# Altium schematic sheet SD NAND.SchDoc
size A4; SheetNumber: 4; SheetTotal: 5
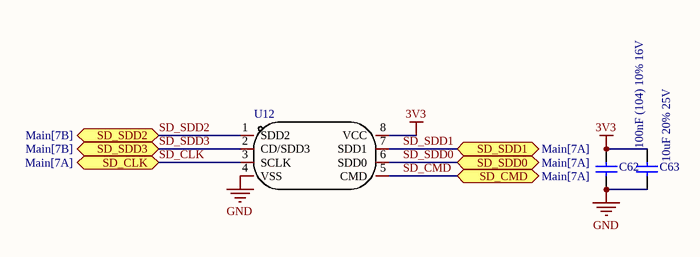
[diagram p0: SD NAND.SchDoc]

## Parts
C62  100nF (104) 10% 16V  [0402_C]
C63  10uF 20% 25V  [0402_C]
U12  CSNP1GCR01-BOW  [LGA-8_L6.0-W8.0-P1.27-TL]  (value not drawn)

## Ports
SD_CLK (bidir, see Main[7A]), SD_CMD (bidir, see Main[7A]), SD_SDD0 (bidir, see Main[7A]), SD_SDD1 (bidir, see Main[7A]), SD_SDD2 (bidir, see Main[7B]), SD_SDD3 (bidir, see Main[7B])

## Nets
3V3: C62.1 C63.2 U12.8(VCC)
GND: C62.2 C63.1 U12.4(VSS)
SD_CLK: U12.3(SCLK) ; port SD_CLK
SD_CMD: U12.5(CMD) ; port SD_CMD
SD_SDD0: U12.6(SDD0) ; port SD_SDD0
SD_SDD1: U12.7(SDD1) ; port SD_SDD1
SD_SDD2: U12.1(SDD2) ; port SD_SDD2
SD_SDD3: U12.2(CD/SDD3) ; port SD_SDD3

## Library data of the parts
C62 = 0402 100nF (104) 10% 16V: 贴片电容; ComponentLink1Description: 供应商链接; ComponentLink1URL: http://www.szlcsc.com/product/details_1877.html; Package: 0402; Supplier: LC; SuppliersPartNumber: C1525
C63 = 0603 10uF (106) 10% 10V: 贴片电容; ComponentLink1Description: 供应商链接; ComponentLink1URL: http://www.szlcsc.com/product/details_20411.html; Package: 0603; Supplier: LC; SuppliersPartNumber: C19702
U12 = CSNP1GCR01-BOW: 免驱动使用，标准SDIO接口，兼容SPI/SD/eMMC接口，兼容各大MCU平台;内置EDC/ECC，坏块管理，垃圾回收算法;可机贴，锁定晶圆和控制器,一致性高；内置SLC晶圆,10W次擦写寿命，通过1万次随机掉电测试，支持工业级温度-40°~+85°。 CS(创世) SD NAND也被很多开发者朋友称为：贴片式TF卡，贴片式SD卡，贴片卡，焊接式SD卡，焊接式TF卡，工业级TF卡，工业级SD卡，嵌入式SD卡等。主要解决了主控(比如STM32系列的MCU单片机 )使用 SLC NAND FLASH,SPI; Manufacturer: CS(创世); Add into BOM: yes; Name: CSNP1GCR01-BOW; Symbol: CSNP1GCR01-BOW; Device: CSNP1GCR01-BOW; LCSC Part Name: 1Gb SD NAND 一代 SD NAND 一代; Supplier Part: C2691593; Manufacturer Part: CSNP1GCR01-BOW; Supplier Footprint: LGA-8(6x8); JLCPCB Part Class: 扩展库; Datasheet: https://atta.szlcsc.com/upload/public/pdf/source/20210222/C2691593_195F15B6690BC3EBF1684FE727FBFF20.pdf; Supplier: LCSC; Convert to PCB: yes